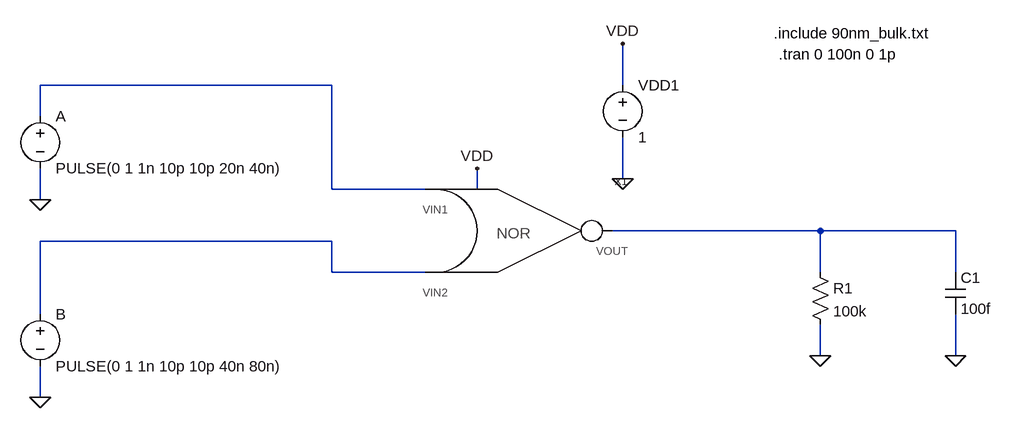
[diagram p0: schematic nor_main.asc]
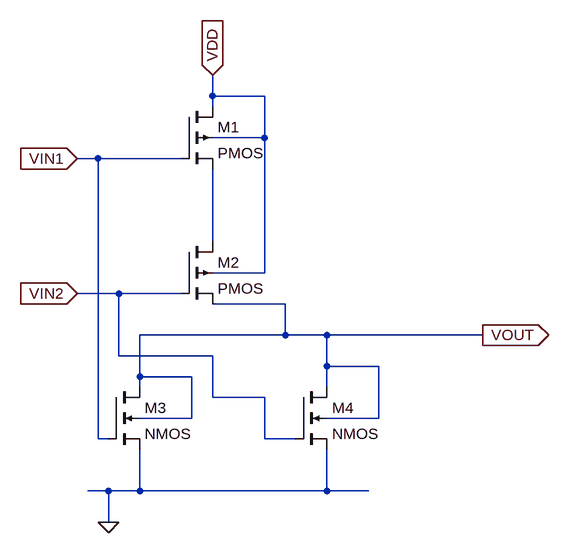
[diagram p1: sub-circuit nor.asc]
nor_main.asc, the LTspice schematic file:
Version 4
SHEET 1 1332 852
WIRE 304 -16 -144 -16
WIRE 752 -16 752 -80
WIRE -144 32 -144 -16
WIRE 752 128 752 64
WIRE 304 144 304 -16
WIRE 464 144 304 144
WIRE 528 144 528 112
WIRE -144 160 -144 112
WIRE 1056 208 736 208
WIRE 1264 208 1056 208
WIRE 304 224 -144 224
WIRE 304 272 304 224
WIRE 464 272 304 272
WIRE 1056 272 1056 208
WIRE 1264 272 1264 208
WIRE -144 336 -144 224
WIRE 1056 400 1056 352
WIRE 1264 400 1264 336
WIRE -144 464 -144 416
FLAG -144 160 0
FLAG -144 464 0
FLAG 752 128 0
FLAG 752 -80 VDD
FLAG 528 112 VDD
FLAG 1056 400 0
FLAG 1264 400 0
SYMBOL voltage -144 16 R0
WINDOW 123 0 0 Left 0
WINDOW 39 0 0 Left 0
SYMATTR InstName A
SYMATTR Value PULSE(0 1 1n 10p 10p 20n 40n)
SYMBOL voltage -144 320 R0
WINDOW 123 0 0 Left 0
WINDOW 39 0 0 Left 0
SYMATTR InstName B
SYMATTR Value PULSE(0 1 1n 10p 10p 40n 80n)
SYMBOL voltage 752 -32 R0
WINDOW 123 0 0 Left 0
WINDOW 39 0 0 Left 0
SYMATTR InstName VDD1
SYMATTR Value 1
SYMBOL nor 528 176 R0
SYMATTR InstName X1
SYMBOL res 1040 256 R0
SYMATTR InstName R1
SYMATTR Value 100k
SYMBOL cap 1248 272 R0
SYMATTR InstName C1
SYMATTR Value 100f
TEXT 984 -96 Left 2 !.include 90nm_bulk.txt
TEXT 992 -64 Left 2 !.tran 0 100n 0 1p

nor.asc, the sub-circuit schematic file:
Version 4
SHEET 1 880 680
WIRE -32 -48 -32 -80
WIRE 48 -48 -32 -48
WIRE -32 -32 -32 -48
WIRE 48 16 48 -48
WIRE 48 16 -32 16
WIRE -208 48 -240 48
WIRE -80 48 -208 48
WIRE -32 176 -32 64
WIRE 48 224 48 16
WIRE 48 224 -32 224
WIRE -176 256 -240 256
WIRE -80 256 -176 256
WIRE 80 272 -32 272
WIRE 80 320 80 272
WIRE 80 320 -144 320
WIRE 144 320 80 320
WIRE 384 320 144 320
WIRE -176 352 -176 256
WIRE -32 352 -176 352
WIRE 144 368 144 320
WIRE 224 368 144 368
WIRE -144 384 -144 320
WIRE -64 384 -144 384
WIRE -144 400 -144 384
WIRE 144 400 144 368
WIRE -32 416 -32 352
WIRE 48 416 -32 416
WIRE -64 448 -64 384
WIRE -64 448 -144 448
WIRE 224 448 224 368
WIRE 224 448 144 448
WIRE -208 480 -208 48
WIRE -192 480 -208 480
WIRE 48 480 48 416
WIRE 96 480 48 480
WIRE -192 560 -224 560
WIRE -144 560 -144 496
WIRE -144 560 -192 560
WIRE 144 560 144 496
WIRE 144 560 -144 560
WIRE 208 560 144 560
WIRE -192 608 -192 560
FLAG -32 -80 VDD
IOPIN -32 -80 In
FLAG -240 48 VIN1
IOPIN -240 48 In
FLAG -240 256 VIN2
IOPIN -240 256 In
FLAG 384 320 VOUT
IOPIN 384 320 Out
FLAG -192 608 0
SYMBOL pmos4 -80 -32 R0
SYMATTR InstName M1
SYMBOL pmos4 -80 176 R0
SYMATTR InstName M2
SYMBOL nmos4 -192 400 R0
SYMATTR InstName M3
SYMBOL nmos4 96 400 R0
SYMATTR InstName M4

The netlist it stands for:
* nor_main.asc
V§A N001 0 PULSE(0 1 1n 10p 10p 20n 40n)
V§B N003 0 PULSE(0 1 1n 10p 10p 40n 80n)
VDD1 VDD 0 1
XX1 N001 N003 N002 VDD nor
R1 N002 0 100k
C1 N002 0 100f

* block symbol definitions
.subckt nor VIN1 VIN2 VOUT VDD
M1 VDD VIN1 N001 VDD PMOS
M2 N001 VIN2 VOUT VDD PMOS
M3 VOUT VIN1 0 VOUT NMOS
M4 VOUT VIN2 0 VOUT NMOS
.ends nor

.model NMOS NMOS
.model PMOS PMOS
.lib standard.mos
.include 90nm_bulk.txt
.tran 0 100n 0 1p
.backanno
.end